# Altium project DOANCHUYENNGANHFINAL.PrjPCB
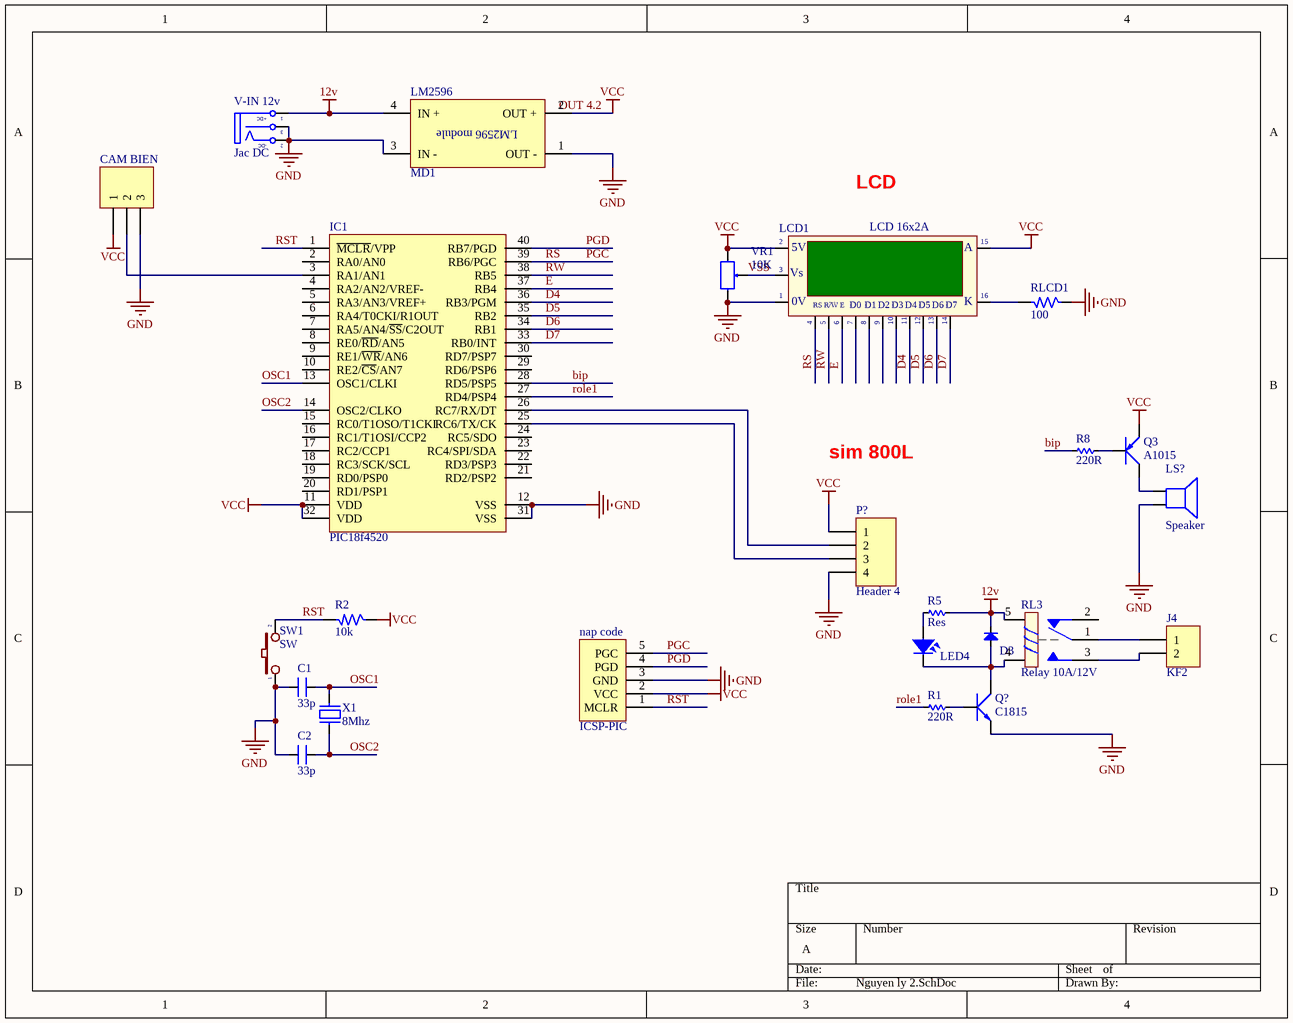
[diagram p0: Nguyen ly 2.SchDoc]
1 sheet, 24 parts. Net scope: global (net labels, ports and power ports of the same name join across sheets).
Board file: BAO TROM PIC16F SIM800L (1).PcbDoc

## Sheet Nguyen ly 2.SchDoc
size A

### Parts
C1  33p  [SM-0805]
C2  33p  [SM-0805]
CAM_BIEN  (no value)  [HDR1X3]
D3  Diode  [DIO-1A-SMALL]  (value not drawn)
IC1  PIC18f4520  [DIP40/W0.6]
J4  KF2  [KF2-5.08]
LCD1  LCD 16x2A  [LCD16X2]
LED4  LED  [LED-5-Yellow]  (value not drawn)
LM2596  MD1  [LM2596]
LS?  Speaker  [SPEAKER]
nap_code  ICSP-PIC  [HDR1X5]
P?  Header 4  [HDR1X4]
Q3  A1015  [QTO-92]
Q?  C1815  [TO92-123]
R1  220R  [RES-SMD-0805]
R2  10k  [SM-0805]
R5  Res  [RES-SMD-0805]
R8  220R  [RES-SMD-0805]
RL3  Relay 10A/12V  [RELAY 5]
RLCD1  100  [SM-0805]
SW1  SW  [SW2]
V-IN_12v  Jac DC  [DC-IN]
VR1  10K  [VR]
X1  8Mhz  [XT2]

### Nets
12v: D3.2(K) LM2596.4(IN_+) R5.1 RL3.5 V-IN_12v.1(T)
GND: C1.1 C2.1 CAM_BIEN.3 IC1.12(VSS) IC1.31(VSS) LCD1.1(GND) LM2596.1(OUT_-) LM2596.3(IN_-) LS?.2 nap_code.3(GND) P?.4 Q?.1(E) RLCD1.1 SW1.1 V-IN_12v.2(TN) V-IN_12v.3(S) VR1.3
VCC: CAM_BIEN.1 IC1.11(VDD) IC1.32(VDD) LCD1.2(VDD) LCD1.15(A) LM2596.2(OUT_+) nap_code.2(VCC) P?.1 Q3.1(E) R2.1 VR1.1
bip: IC1.28(RD5/PSP5) R8.2
D4: IC1.36(RB3/PGM) LCD1.11(D4)
D5: IC1.35(RB2) LCD1.12(D5)
D6: IC1.34(RB1) LCD1.13(D6)
D7: IC1.33(RB0/INT) LCD1.14(D7)
E: IC1.37(RB4) LCD1.6(~{EN})
OSC1: C1.2 IC1.13(OSC1/CLKI) X1.2
OSC2: C2.2 IC1.14(OSC2/CLKO) X1.1
PGC: IC1.39(RB6/PGC) LCD1.4(RS) nap_code.5(PGC)  [also labelled RS]
PGD: IC1.40(RB7/PGD) nap_code.4(PGD)
role1: IC1.27(RD4/PSP4) R1.2
RST: IC1.1(~{MCLR}/VPP) nap_code.1(MCLR) R2.2 SW1.2
RW: IC1.38(RB5) LCD1.5(R/~{W})
VSS: LCD1.3(VEE) VR1.2
NetCAM_BIEN_2: CAM_BIEN.2 IC1.3(RA1/AN1)
NetD3_1: D3.1(A) LED4.2 Q?.2(C) RL3.4
NetIC1_25: IC1.25(RC6/TX/CK) P?.3
NetIC1_26: IC1.26(RC7/RX/DT) P?.2
NetJ4_1: J4.1 RL3.1
NetJ4_2: J4.2 RL3.3
NetLCD1_16: LCD1.16(K) RLCD1.2
NetLED4_1: LED4.1 R5.2
NetLS?_1: LS?.1 Q3.2(C)
NetQ3_3: Q3.3(B) R8.1
NetQ?_3: Q?.3(B) R1.1

Not connected (* = marked no-connect by the designer): IC1 2(RA0/AN0) 4(RA2/AN2/VREF-) 5(RA3/AN3/VREF+) 6(RA4/T0CKI/R1OUT) 7(RA5/AN4/~{SS}/C2OUT) 8(RE0/~{RD}/AN5) 9(RE1/~{WR}/AN6) 10(RE2/~{CS}/AN7) 15(RC0/T1OSO/T1CKI) 16(RC1/T1OSI/CCP2) 17(RC2/CCP1) 18(RC3/SCK/SCL) 19(RD0/PSP0) 20(RD1/PSP1) 21(RD2/PSP2) 22(RD3/PSP3) 23(RC4/SPI/SDA) 24(RC5/SDO) 29(RD6/PSP6) 30(RD7/PSP7); LCD1 7(D0) 8(D1) 9(D2) 10(D3); RL3 2

### Notes on the sheet
- LCD
- sim 800L
- Labels drawn without touching a wire or pin: OUT 4.2
- (in symbol DCIN) +DC; -DC
- (in symbol LCD16x2A) 5V; Vs; |; 0V; R/W; E
- (in symbol LM2596 Module) LM2596 module

### Library data of the parts
C1 C2 = CM: Cap SMD; Value: 103
CAM_BIEN = Header 3: Header, 3-Pin; LatestRevisionDate: 17-Jul-2002; LatestRevisionNote: Re-released for DXP Platform.; Publisher: Altium Limited
D3 = Diode: Default Diode; Code - JEDEC: DO-214-AB; Value: 1N5007; Published: 8-Jun-2000; Revision: July-2002: Re-released for DXP Platform.; Publisher: Altium Limited
IC1 = 16F877A: 8K FLASH, 368B RAM, 256B EFROM; Value: DIP 40
J4 = KF2: Manufacturer: Würth Elektronik eiSos GmbH; partNo: 691103110002; ComponentLink1 Description: Manufacturer; ComponentLink2 Description: Datasheet; NoPins: 2; Created Date: 29 October 2013; ComponentLink1URL: http://www.we-online.com; ComponentLink2URL: http://katalog.we-online.de/em/datasheet/6911031100xx.pdf; Created by: Karrer Zheng
LCD1 = LCD16x2A: LCD dipslay 16 char, 2 line; Value: LCD16x2A
LED4 = LED: LED Single colour Green and Red; Value: LED 3 ly Single Colour
LM2596 = LM2596 Module
LS? = Speaker: Loudspeaker; Published: 24-Mar-1999; LatestRevisionDate: 17-Jul-2002; LatestRevisionNote: Re-released for DXP Platform.; PackageReference: PIN2; Publisher: Altium Limited
nap_code = ICSP-PIC: Header, 5-Pin; LatestRevisionDate: 17-Jul-2002; LatestRevisionNote: Re-released for DXP Platform.; Publisher: Altium Limited
P? = Header 4: Header, 4-Pin; LatestRevisionDate: 17-Jul-2002; LatestRevisionNote: Re-released for DXP Platform.; Publisher: Altium Limited
Q3 = A1015: PNP 600mW, ECB; Value: A1015
Q? = C1815: NPN 600mW, ECB; Value: C1815
R1 R5 R8 = Res-SMD: Resistor; Manufacturer: Generic Components; Class: Passive; Published: 08/06/2000; Publisher: Altium Hobart Technology Centre
R2 RLCD1 = R: Resistor 1/4W; Value: R1/4W - 1K
RL3 = Relay 5: Relay SPDT,10A - 12VDC 5 Pin; Value: Relay SPDT, 10A, 12V
SW1 = SW2: Switch button 2 pin; Value: SW chip 2 pin
V-IN_12v = DCIN: Jac DC input; Value: Jac DC
VR1 = VR: Var Resistor; Value: VR 10K
X1 = XT2: Crystal For all Crystal 2pin.; Value: 4Mhz